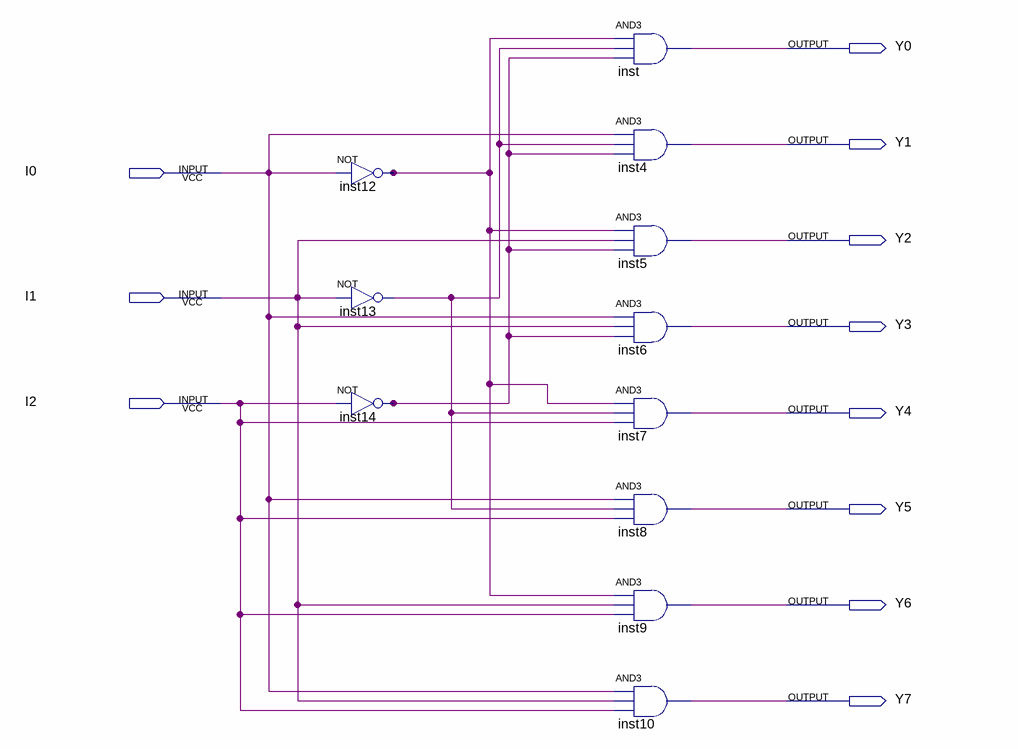
[diagram p0: schematic sheet]
// Quartus schematic 38decoder.bdf as structural Verilog: 11 symbols, 11 pins
module \38decoder  (
  input  I0,
  input  I1,
  input  I2,
  output Y0,
  output Y1,
  output Y2,
  output Y3,
  output Y4,
  output Y5,
  output Y6,
  output Y7
);

  wire inst12_out, inst13_out, inst14_out;

  not inst12 (inst12_out, I0);
  not inst13 (inst13_out, I1);
  not inst14 (inst14_out, I2);
  and inst (Y0, inst12_out, inst13_out, inst14_out);
  and inst4 (Y1, I0, inst13_out, inst14_out);
  and inst5 (Y2, inst12_out, I1, inst14_out);
  and inst6 (Y3, I0, I1, inst14_out);
  and inst7 (Y4, inst12_out, inst13_out, I2);
  and inst8 (Y5, I0, inst13_out, I2);
  and inst9 (Y6, inst12_out, I1, I2);
  and inst10 (Y7, I0, I1, I2);
endmodule
